# Altium project LaserLider.PrjPcb (part 4 of 4)
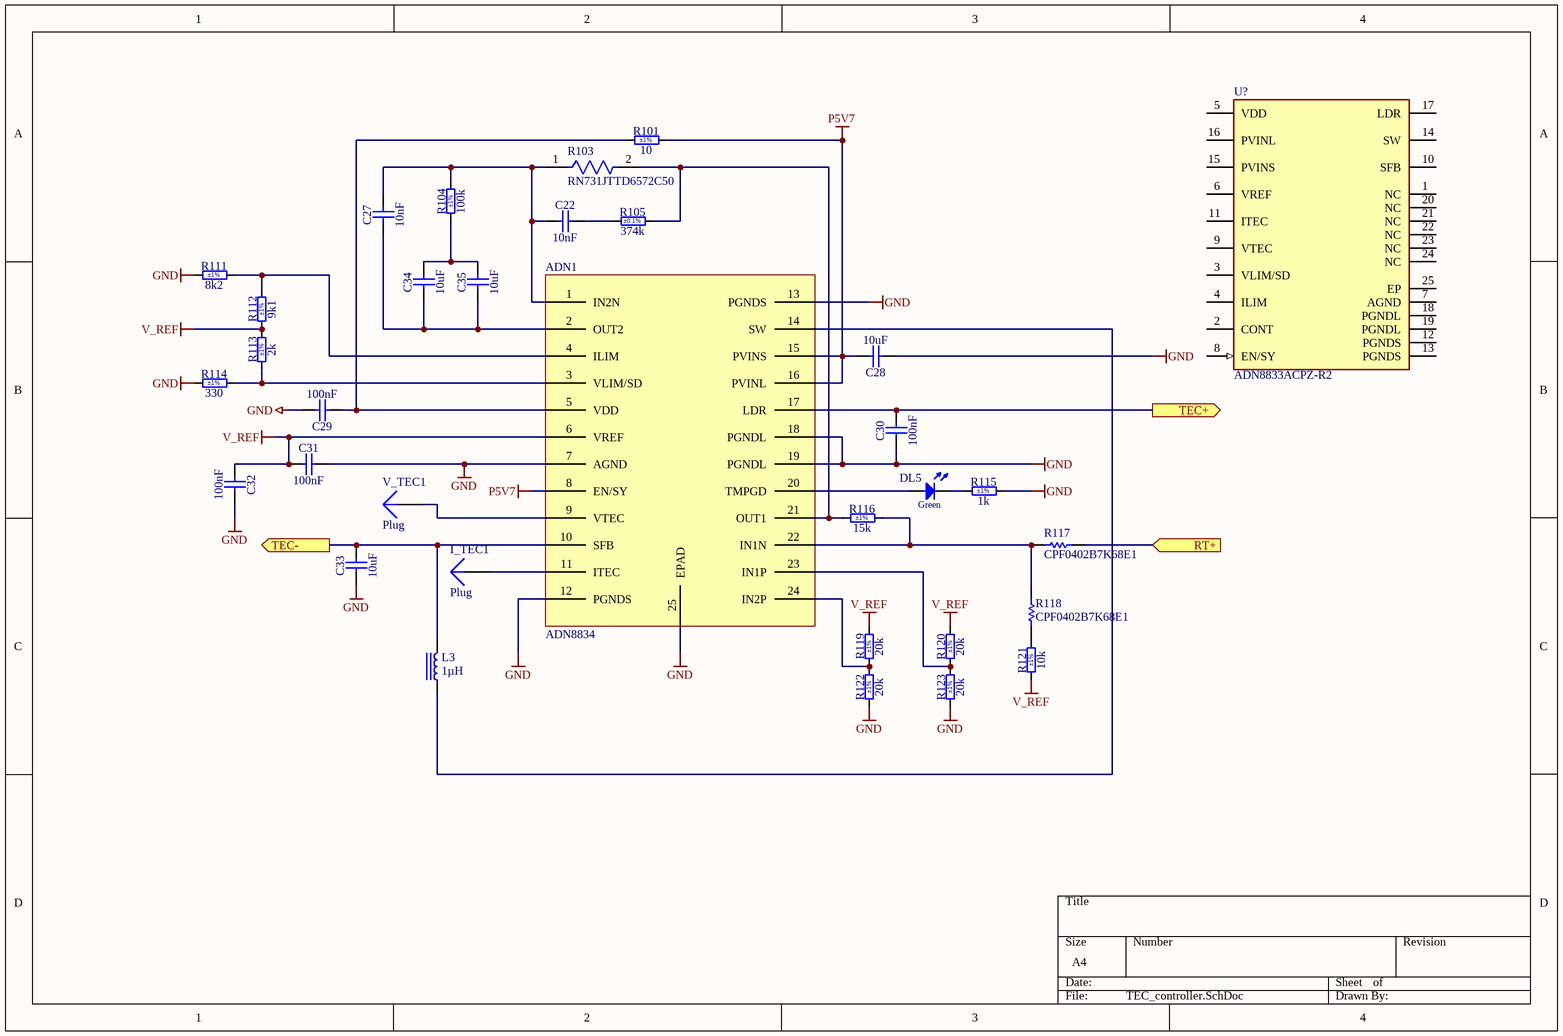
[diagram p8: TEC_controller.SchDoc]

## Nets that join several sheets
3V3_VDD: LaserLider (W1.1), MCU (21 pins), Ethernet (9 pins), Power (6 pins), VCSEL (8 pins), Photoreciever (9 pins), USB (C75.2 C76.2 IC3.8)
GND: LaserLider (J8.5 W1.3), MCU (25 pins), Ethernet (23 pins), Power (47 pins), VCSEL (46 pins), Photoreciever (18 pins), USB (C75.1 C76.1 IC3.5), TEC_controller (17 pins)
N12V: Power (6 pins), VCSEL (7 pins), Photoreciever (M1.1)
N18V: Power (10 pins), VCSEL (L14.1 R45.1 R99.1)
P5V7: Power (8 pins), VCSEL (C81.1 L13.1 U4.5), Photoreciever (M1.3), TEC_controller (5 pins)
ADC_IN: MCU (U10.30), Photoreciever (7 pins)
ADC_TC: MCU (U10.15), VCSEL (C96.2 J10.14 R102.1), TEC_controller (R117.2)
COMP_IMP: MCU (U10.39), VCSEL (IC6.4 J7.1 R124.2 U4.1)
DAC_OUT: MCU (U10.28), VCSEL (IC6.6)
DAC_RDY: MCU (U10.2), Photoreciever (R37.1 U2.5)
DDS_DATA: MCU (U10.44), VCSEL (U11.6)
DDS_FSYNC: MCU (U10.41), VCSEL (U11.8)
DDS_SCLK: MCU (U10.42), VCSEL (U11.7)
EXTI0: LaserLider (J8.4 R53.2), MCU (U10.81), Photoreciever (IC8.1 R38.1 R52.1)
EXTI1: LaserLider (J8.3 R54.2), MCU (U10.82), Photoreciever (IC8.7 R52.2)
EXTI2: LaserLider (J8.2 R109.2), MCU (U10.83), Photoreciever (IC7.1 R24.1 R32.1)
EXTI3: LaserLider (J8.1 R110.2), MCU (U10.84), Photoreciever (IC7.7 R32.2)
I2C1_SCL: MCU (R22.1 U10.92), Photoreciever (U2.2)
I2C1_SDA: MCU (R21.1 U10.93), Photoreciever (U2.3)
LDAC: MCU (U10.1), Photoreciever (U2.4)
NetADN1_10: VCSEL (J10.16), TEC_controller (ADN1.10 C33.2 L3.2)
NetADN1_17: VCSEL (J10.17), TEC_controller (ADN1.17 C30.2)
NRST: LaserLider (W1.5), MCU (U10.14), Ethernet (U1.15)
RMII_CRS_DV: MCU (U10.31), Ethernet (R13.1)
RMII_MDC: MCU (U10.16), Ethernet (U1.13)
RMII_MDIO: MCU (U10.24), Ethernet (R14.2 U1.12)
RMII_REF_CLK: MCU (U10.23), Ethernet (R17.1)
RMII_RXD0: MCU (U10.32), Ethernet (R9.1)
RMII_RXD1: MCU (U10.33), Ethernet (R10.1)
RMII_TX_EN: MCU (U10.47), Ethernet (U1.16)
RMII_TXD0: MCU (U10.51), Ethernet (U1.17)
RMII_TXD1: MCU (U10.52), Ethernet (U1.18)
SIG_SEL: MCU (U10.95), VCSEL (IC6.1)
SWCLK: LaserLider (W1.2), MCU (U10.76)
SWDIO: LaserLider (W1.4), MCU (U10.72)
TIM1_ETR: LaserLider (R53.1), MCU (U10.37)
TIM2_ETR: LaserLider (R54.1), MCU (U10.77)
TIM4_ETR: LaserLider (R109.1), MCU (U10.97)
TIM8_ETR: LaserLider (R110.1), MCU (U10.22)
UART_RX: MCU (U10.54), USB (IC3.6)
UART_TX: MCU (U10.53), USB (IC3.7)